# Altium project Evb board STM32H7 Fullcolor V1l0.PrjPcb (part 2 of 2)

## Sheet [06] - AUDIO.SchDoc
size A3; DocumentNumber: 7; SheetNumber: 6; SheetTotal: 10
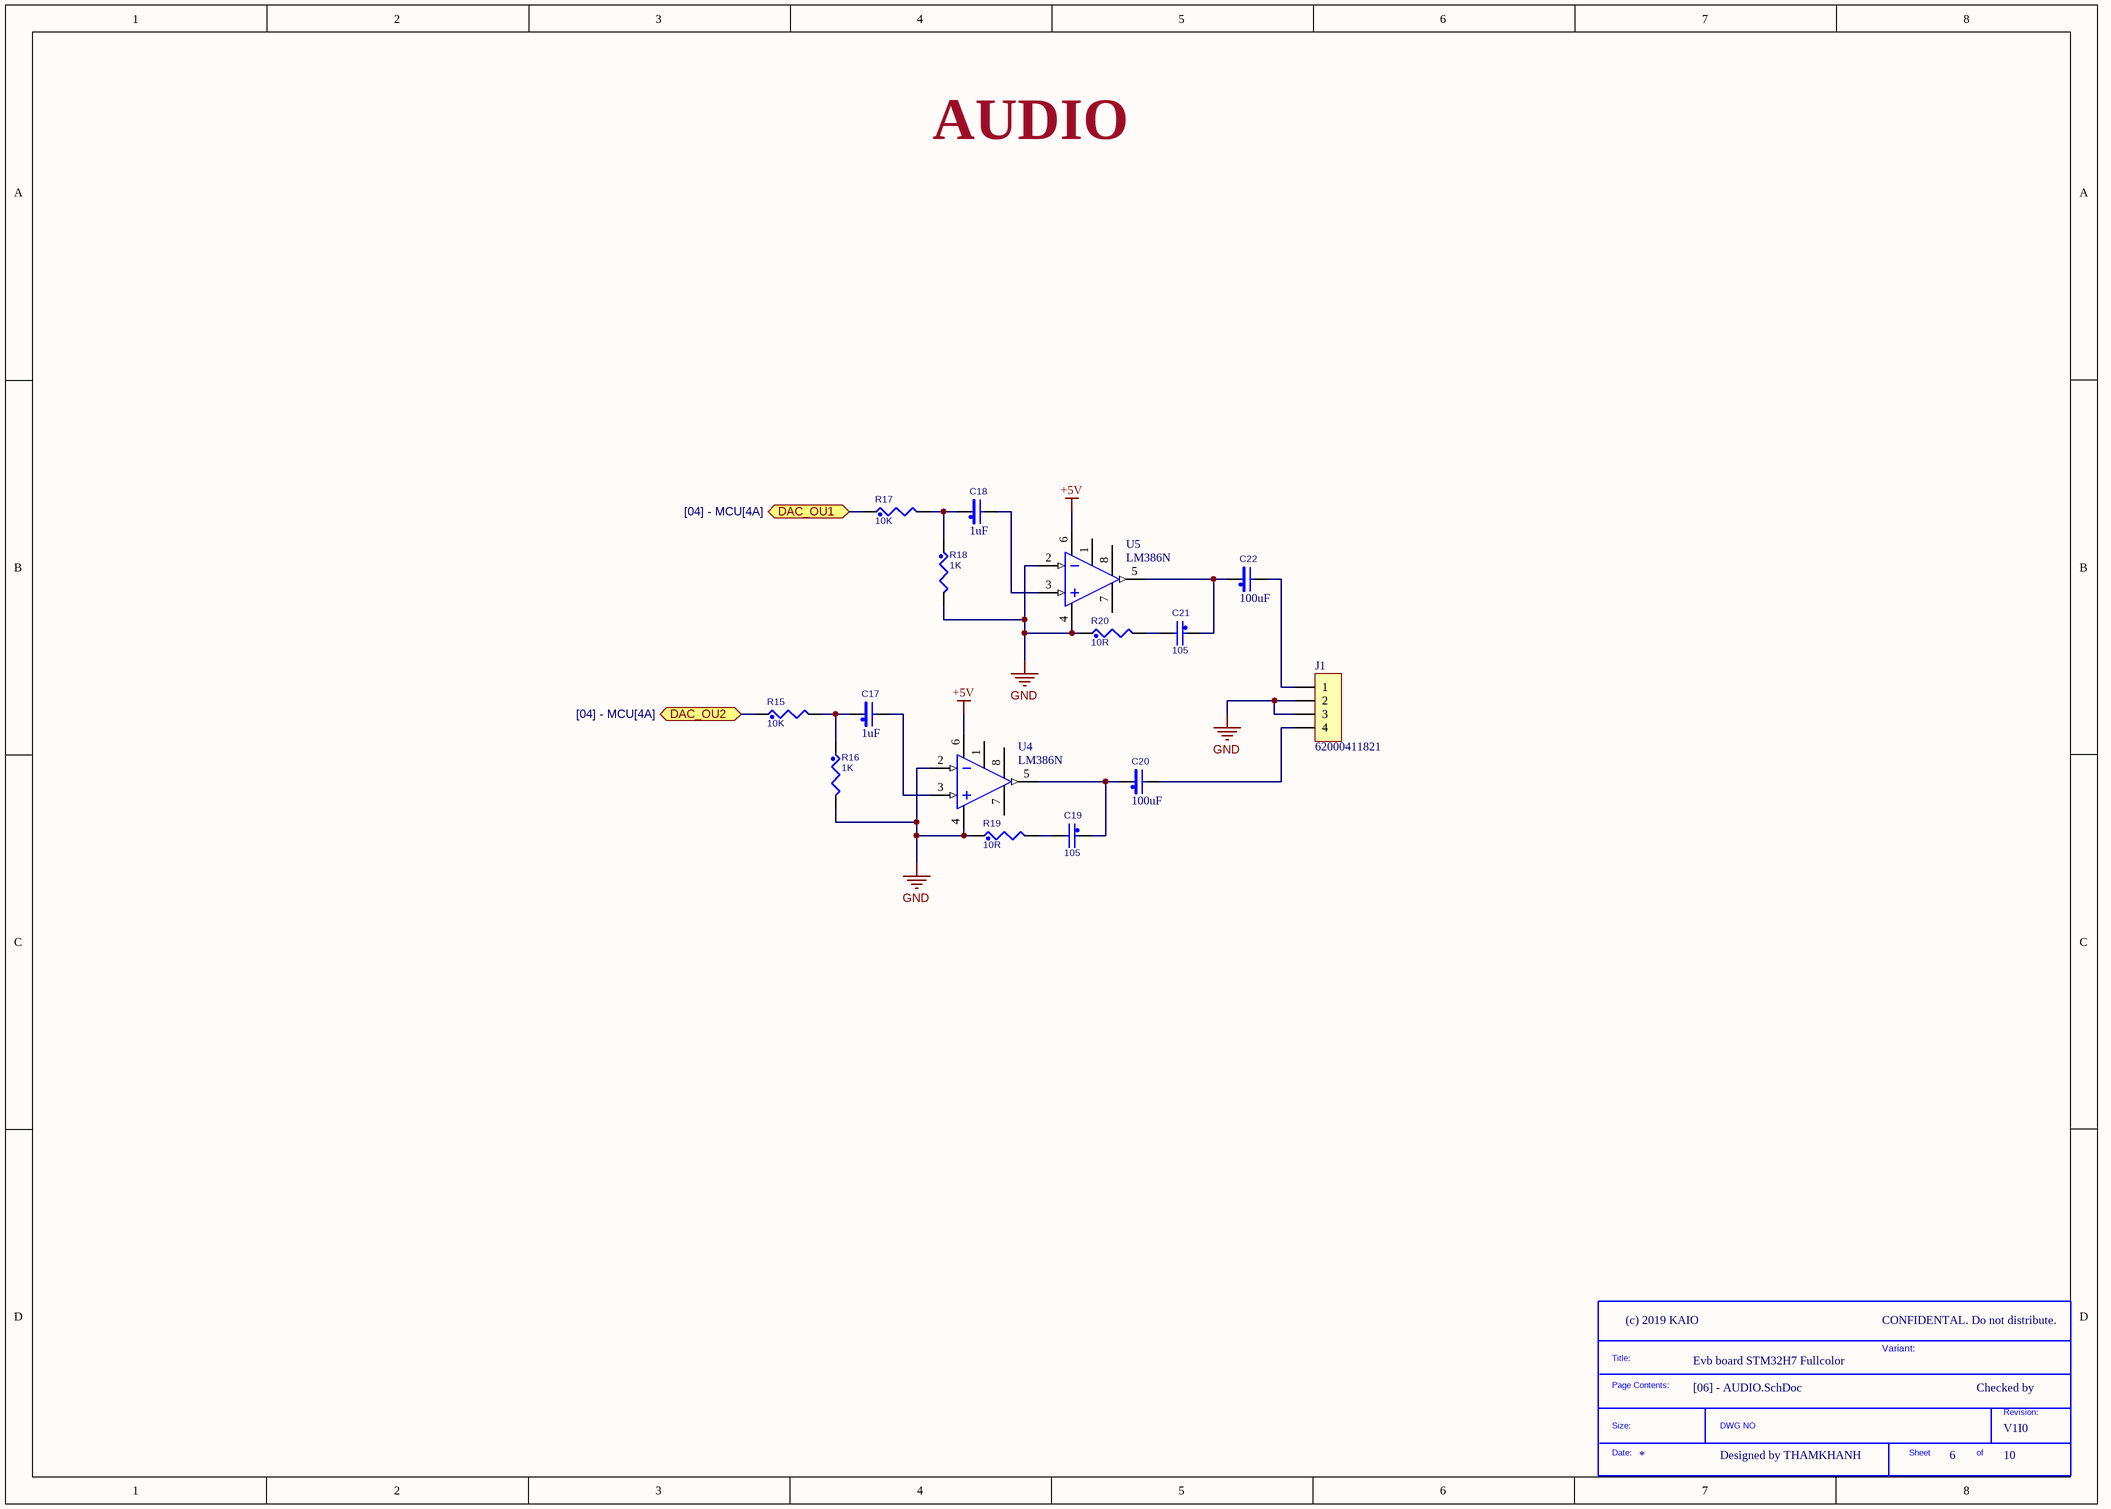
[diagram p6: [06] - AUDIO.SchDoc]

### Parts
(Parts that share a designator on the sheet are numbered #1, #2 ... from top to bottom, then left to right.)
*?#6  SDTitleBlock  (value not drawn)  (graphical)
C17  1uF  [CAP-TAN-SMD-3216]
C18  1uF  [CAP-TAN-SMD-3216]
C19  105  [C0805]
C20  100uF  [CAP-TAN-SMD-3530]
C21  105  [C0805]
C22  100uF  [CAP-TAN-SMD-3530]
J1  62000411821  [62000411121]
R15  10K  [R0603]
R16  1K  [R0603]
R17  10K  [R0603]
R18  1K  [R0603]
R19  10R  [R0805]
R20  10R  [R0805]
U4  LM386N  [SOIC127P390X490-8N]
U5  LM386N  [SOIC127P390X490-8N]

### Ports
DAC_OU1 (bidir, see [04] - MCU[4A]), DAC_OU2 (bidir, see [04] - MCU[4A])

### Nets
+5V: U4.6(+V) U5.6(+V)
GND: J1.2 J1.3 R16.2 R18.2 R19.1 R20.1 U4.2(IN-) U4.4(-V) U5.2(IN-) U5.4(-V)
DAC_OU1: R17.1 ; port DAC_OU1
DAC_OU2: R15.1 ; port DAC_OU2
NetC17_1: C17.1 R15.2 R16.1
NetC17_2: C17.2 U4.3(IN+)
NetC18_1: C18.1 R17.2 R18.1
NetC18_2: C18.2 U5.3(IN+)
NetC19_1: C19.1 C20.1 U4.5(OUT)
NetC19_2: C19.2 R19.2
NetC20_2: C20.2 J1.4
NetC21_1: C21.1 C22.1 U5.5(OUT)
NetC21_2: C21.2 R20.2
NetC22_2: C22.2 J1.1

Not connected (* = marked no-connect by the designer): U4 1(-V) 7 8(-V); U5 1(-V) 7 8(-V)

### Notes on the sheet
- AUDIO
- CONFIDENTAL. Do not distribute.
- Variant:
- Checked by
- Designed by THAMKHANH
- (in symbol SDTitleBlock) Title:; Page Contents:; Revision:; Size:; DWG NO; Date:; Sheet; of

### Library data of the parts
C17 C18 = CAP-SMD-TANTALUM: Tantalum capacitor , T491A475K016AT, KEMET; Manufacturer Part Number: T491A105K016AT; Tolerance: 20%; Voltage Rating: 16V; ESR (Equivalent Series Resistance): 10R; Leakage Current: 500nA; Polarity: Polar; Dissipation Factor: 4%; Life (Hours): 2000Hour; Ripple Current: 87mA; Manufacturer: KEMET; Mount: Surface Mount,PCB; Case/Package: 1206; Number of Pins: 2; Case Code (Imperial): 1206; Case Code (Metric): 3216; Dielectric Material: Tantalum; Min Operating Temperature: -55°C; Max Operating Temperature: 125°C; Capacitance: 1uF; Packaging: Tape and Reel; Package Quantity: 1; Voltage Rating (DC): 16V; Termination: SMD/SMT; Voltage: 16V; Features: General Purpose; Length: 3.2mm; Height: 1.6mm; Width: 1.6mm; Height - Seated (Max): 0.071inch; Depth: 1.6mm; REACH SVHC: No SVHC; Lead Free: Lead Free; ComponentLink1URL: https://4donline.ihs.com/images/VipMasterIC/IC/KEME/KEME-S-A0006487387/KEME-S-A0006487387-1.pdf?hkey=52A5661711E402568146F3353EA87419&src-supplier=Element14; ComponentLink1Description: https://4donline.ihs.com/images/VipMasterIC/IC/KEME/KEME-S-A0006487387/KEME-S-A0006487387-1.pdf?hkey=52A5661711E402568146F3353EA87419&src-supplier=Element14; ComponentLink2URL: http://www.rapidonline.com/pdf/458280_da_en_01.pdf?src-supplier=Rapid+Electronics; ComponentLink2Description: http://www.rapidonline.com/pdf/458280_da_en_01.pdf?src-supplier=Rapid+Electronics; ComponentLink3URL: http://www.jameco.com/Jameco/Products/ProdDS/1573169.pdf?src-supplier=Jameco; ComponentLink3Description: http://www.jameco.com/Jameco/Products/ProdDS/1573169.pdf?src-supplier=Jameco; ComponentLink4URL: http://www.kemet.com/kemet/web/homepage/kechome.nsf/file/T491%20Series/$file/KEM_T2005_T491.pdf?src-supplier=Farnell; ComponentLink4Description: http://www.kemet.com/kemet/web/homepage/kechome.nsf/file/T491%20Series/$file/KEM_T2005_T491.pdf?src-supplier=Farnell; ComponentLink5URL: http://www.mouser.com/ds/2/212/KEM_T2005_T491-1093550.pdf?src-supplier=Mouser; ComponentLink5Description: http://www.mouser.com/ds/2/212/KEM_T2005_T491-1093550.pdf?src-supplier=Mouser; ComponentLink6URL: https://www.distrelec.biz/Web/Downloads/_t/ds/KEM_T2005_T491_eng_tds.pdf?mime=application%2Fpdf&src-supplier=Distrelec; ComponentLink6Description: https://www.distrelec.biz/Web/Downloads/_t/ds/KEM_T2005_T491_eng_tds.pdf?mime=application%2Fpdf&src-supplier=Distrelec; ComponentLink7URL: https://api.kemet.com/component-edge/download/datasheet/T491A105K016AT.pdf?src-supplier=Digi-Key; ComponentLink7Description: https://api.kemet.com/component-edge/download/datasheet/T491A105K016AT.pdf?src-supplier=Digi-Key; ComponentLink8URL: http://www.kemet.com/kemet/web/homepage/kechome.nsf/file/T491%20Series/$file/KEM_T2005_T491.pdf?src-supplier=Element14; ComponentLink8Description: http://www.kemet.com/kemet/web/homepage/kechome.nsf/file/T491%20Series/$file/KEM_T2005_T491.pdf?src-supplier=Element14; ComponentLink9URL: http://uk.rs-online.com/webdocs/1529/0900766b815290c9.pdf?src-supplier=RSComponents; ComponentLink9Description: http://uk.rs-online.com/webdocs/1529/0900766b815290c9.pdf?src-supplier=RSComponents; ComponentLink10URL: https://www.alliedelec.com/m/d/1172a60f7bb3eb66344f86e8fb9ddbde.pdf?src-supplier=Allied+Electronics; ComponentLink10Description: https://www.alliedelec.com/m/d/1172a60f7bb3eb66344f86e8fb9ddbde.pdf?src-supplier=Allied+Electronics; Radiation Hardening: No; ComponentLink11URL: https://api.kemet.com/component-edge/download/datasheet/T491A475K016AT.pdf?src-supplier=Digi-Key; ComponentLink11Description: https://api.kemet.com/component-edge/download/datasheet/T491A475K016AT.pdf?src-supplier=Digi-Key; ComponentLink12URL: http://www.jameco.com/Jameco/Products/ProdDS/1573425.pdf?src-supplier=Jameco; ComponentLink12Description: http://www.jameco.com/Jameco/Products/ProdDS/1573425.pdf?src-supplier=Jameco; ComponentLink13URL: http://uk.rs-online.com/webdocs/1515/0900766b81515525.pdf?src-supplier=RSComponents; ComponentLink13Description: http://uk.rs-online.com/webdocs/1515/0900766b81515525.pdf?src-supplier=RSComponents; ComponentLink14URL: http://www.farnell.com/datasheets/1854511.pdf?src-supplier=Element14; ComponentLink14Description: http://www.farnell.com/datasheets/1854511.pdf?src-supplier=Element14; ComponentLink15URL: http://www.rapidonline.com/pdf/458253_da_en_01.pdf?src-supplier=Rapid+Electronics; ComponentLink15Description: http://www.rapidonline.com/pdf/458253_da_en_01.pdf?src-supplier=Rapid+Electronics; ComponentLink16URL: https://produktinfo.conrad.com/datenblaetter/450000-474999/458253-da-01-en-TANTAL_KONDENSATOR_T491A475K016AT.pdf?src-supplier=Conrad; ComponentLink16Description: https://produktinfo.conrad.com/datenblaetter/450000-474999/458253-da-01-en-TANTAL_KONDENSATOR_T491A475K016AT.pdf?src-supplier=Conrad
C19 C21 = CAP-SMD-CERAMIC: Surface Mound Multilayer Ceramic Chip Capacitor (SMD MLCC); Manufacturer: TDK Corporation; Manufacturer Part Number: C2012X5R1C226K; Capacitance: 22pF; Voltage - Rated: 16V; Tolerance: ±10%; Temperature Coefficient: X5R; .Checked PCB: RF; RoHS: RoHS Compliant; Category: Capacitors; Mounting Type: Surface Mount, MLCC; Operating Temperature: -55°C ~ 85°C; Applications: General Purpose; Ratings: -; Package / Case: 0805 (2012 Metric); Size / Dimension: 0.079" L x 0.049" W (2.00mm x 1.25mm); Height - Seated (Max): -; Thickness (Max): 0.057" (1.45mm); Lead Spacing: -; Features: -; Packaging: Cut Tape (CT); Lead Style: -; ComponentLink1URL: http://www.tdk.com/pdf/general_B11.pdf; ComponentLink1Description: http://www.tdk.com/pdf/general_B11.pdf; .Checked SCH: RF
C20 C22 = CAP-SMD-TANTALUM: Tantalum capacitor , T491A475K016AT, KEMET; Manufacturer Part Number: T491A105K016AT; Capacitance: 1uF; Tolerance: 20%; Voltage Rating: 16V; ESR (Equivalent Series Resistance): 10R; Leakage Current: 500nA; Polarity: Polar; Dissipation Factor: 4%; Life (Hours): 2000Hour; Ripple Current: 87mA; Manufacturer: KEMET; Mount: Surface Mount,PCB; Case/Package: 1206; Number of Pins: 2; Case Code (Imperial): 1206; Case Code (Metric): 3216; Dielectric Material: Tantalum; Min Operating Temperature: -55°C; Max Operating Temperature: 125°C; Packaging: Tape and Reel; Package Quantity: 1; Voltage Rating (DC): 16V; Termination: SMD/SMT; Voltage: 16V; Features: General Purpose; Length: 3.2mm; Height: 1.6mm; Width: 1.6mm; Height - Seated (Max): 0.071inch; Depth: 1.6mm; REACH SVHC: No SVHC; Lead Free: Lead Free; ComponentLink1URL: https://4donline.ihs.com/images/VipMasterIC/IC/KEME/KEME-S-A0006487387/KEME-S-A0006487387-1.pdf?hkey=52A5661711E402568146F3353EA87419&src-supplier=Element14; ComponentLink1Description: https://4donline.ihs.com/images/VipMasterIC/IC/KEME/KEME-S-A0006487387/KEME-S-A0006487387-1.pdf?hkey=52A5661711E402568146F3353EA87419&src-supplier=Element14; ComponentLink2URL: http://www.rapidonline.com/pdf/458280_da_en_01.pdf?src-supplier=Rapid+Electronics; ComponentLink2Description: http://www.rapidonline.com/pdf/458280_da_en_01.pdf?src-supplier=Rapid+Electronics; ComponentLink3URL: http://www.jameco.com/Jameco/Products/ProdDS/1573169.pdf?src-supplier=Jameco; ComponentLink3Description: http://www.jameco.com/Jameco/Products/ProdDS/1573169.pdf?src-supplier=Jameco; ComponentLink4URL: http://www.kemet.com/kemet/web/homepage/kechome.nsf/file/T491%20Series/$file/KEM_T2005_T491.pdf?src-supplier=Farnell; ComponentLink4Description: http://www.kemet.com/kemet/web/homepage/kechome.nsf/file/T491%20Series/$file/KEM_T2005_T491.pdf?src-supplier=Farnell; ComponentLink5URL: http://www.mouser.com/ds/2/212/KEM_T2005_T491-1093550.pdf?src-supplier=Mouser; ComponentLink5Description: http://www.mouser.com/ds/2/212/KEM_T2005_T491-1093550.pdf?src-supplier=Mouser; ComponentLink6URL: https://www.distrelec.biz/Web/Downloads/_t/ds/KEM_T2005_T491_eng_tds.pdf?mime=application%2Fpdf&src-supplier=Distrelec; ComponentLink6Description: https://www.distrelec.biz/Web/Downloads/_t/ds/KEM_T2005_T491_eng_tds.pdf?mime=application%2Fpdf&src-supplier=Distrelec; ComponentLink7URL: https://api.kemet.com/component-edge/download/datasheet/T491A105K016AT.pdf?src-supplier=Digi-Key; ComponentLink7Description: https://api.kemet.com/component-edge/download/datasheet/T491A105K016AT.pdf?src-supplier=Digi-Key; ComponentLink8URL: http://www.kemet.com/kemet/web/homepage/kechome.nsf/file/T491%20Series/$file/KEM_T2005_T491.pdf?src-supplier=Element14; ComponentLink8Description: http://www.kemet.com/kemet/web/homepage/kechome.nsf/file/T491%20Series/$file/KEM_T2005_T491.pdf?src-supplier=Element14; ComponentLink9URL: http://uk.rs-online.com/webdocs/1529/0900766b815290c9.pdf?src-supplier=RSComponents; ComponentLink9Description: http://uk.rs-online.com/webdocs/1529/0900766b815290c9.pdf?src-supplier=RSComponents; ComponentLink10URL: https://www.alliedelec.com/m/d/1172a60f7bb3eb66344f86e8fb9ddbde.pdf?src-supplier=Allied+Electronics; ComponentLink10Description: https://www.alliedelec.com/m/d/1172a60f7bb3eb66344f86e8fb9ddbde.pdf?src-supplier=Allied+Electronics; Radiation Hardening: No; ComponentLink11URL: https://api.kemet.com/component-edge/download/datasheet/T491A475K016AT.pdf?src-supplier=Digi-Key; ComponentLink11Description: https://api.kemet.com/component-edge/download/datasheet/T491A475K016AT.pdf?src-supplier=Digi-Key; ComponentLink12URL: http://www.jameco.com/Jameco/Products/ProdDS/1573425.pdf?src-supplier=Jameco; ComponentLink12Description: http://www.jameco.com/Jameco/Products/ProdDS/1573425.pdf?src-supplier=Jameco; ComponentLink13URL: http://uk.rs-online.com/webdocs/1515/0900766b81515525.pdf?src-supplier=RSComponents; ComponentLink13Description: http://uk.rs-online.com/webdocs/1515/0900766b81515525.pdf?src-supplier=RSComponents; ComponentLink14URL: http://www.farnell.com/datasheets/1854511.pdf?src-supplier=Element14; ComponentLink14Description: http://www.farnell.com/datasheets/1854511.pdf?src-supplier=Element14; ComponentLink15URL: http://www.rapidonline.com/pdf/458253_da_en_01.pdf?src-supplier=Rapid+Electronics; ComponentLink15Description: http://www.rapidonline.com/pdf/458253_da_en_01.pdf?src-supplier=Rapid+Electronics; ComponentLink16URL: https://produktinfo.conrad.com/datenblaetter/450000-474999/458253-da-01-en-TANTAL_KONDENSATOR_T491A475K016AT.pdf?src-supplier=Conrad; ComponentLink16Description: https://produktinfo.conrad.com/datenblaetter/450000-474999/458253-da-01-en-TANTAL_KONDENSATOR_T491A475K016AT.pdf?src-supplier=Conrad
J1 = JP4 2.00MM Single Socket: WR-PHD 2.00 mm Socket Header; Manufacturer: W¨¹rth Elektronik eiSos GmbH; ComponentLink1 Description: Manufacturer; ComponentLink2 Description: Datasheet; NoPins: 04; Created Date: 2 April 2013; partNo: 62000411821; ComponentLink1URL: http://www.we-online.com; ComponentLink2URL: http://katalog.we-online.de/em/datasheet/6200xx11821.pdf; Created by: Karrer Zheng
R15-R20 = RES-SMD: RES 0R OHM 1/8W 1% SMD; Manufacturer: Yageo; Manufacturer Part Number: RC0402FR-0749R9L; Power (Watts): 0.063W, 1/16W; .Checked PCB: used; Temperature Coefficient: ±100ppm/°C; Resistance: 3.3kR; Power Rating: 125mW; Voltage Rating: 100V; Category: Resistors; Supplier Part Number: 311-49.9LRCT-ND; Package / Case: 0402 (1005 Metric); Price 1k [$]: 0.01421; Tolerance: ±1%; Value: 0R; .Checked SCH: used; Supplier: Digikey; RoHS: RoHS Compliant; Composition: Thick Film; Features: -; Size / Dimension: 0.039" L x 0.020" W (1.00mm x 0.50mm); Height: 0.016" (0.40mm); Number of Terminations: 2; Packaging: Cut Tape (CT); ComponentLink1URL: http://www.yageo.com/documents/recent/PYu-RC0402_51_RoHS_L_6.pdf; ComponentLink1Description: http://www.yageo.com/documents/recent/PYu-RC0402_51_RoHS_L_6.pdf; Resistance (Ohms): 0R; Mount: Surface Mount; Case/Package: 0805; Number of Pins: 2; Contact Plating: Tin; Case Code (Metric): 2012; Case Code (Imperial): 0805; Min Operating Temperature: -55°C; Max Operating Temperature: 155°C; Package Quantity: 1; Termination: SMD/SMT; Military Standard: Not; Max Power Dissipation: 125mW; Voltage Rating (DC): 100V; Length: 2mm; Width: 1.25mm; Depth: 1.25mm; Radiation Hardening: No; REACH SVHC: No SVHC; Lead Free: Lead Free; ComponentLink2URL: http://www.farnell.com/datasheets/485442.pdf?src-supplier=Farnell; ComponentLink2Description: http://www.farnell.com/datasheets/485442.pdf?src-supplier=Farnell; ComponentLink3URL: http://uk.rs-online.com/webdocs/0bee/0900766b80beefcc.pdf?src-supplier=RSComponents; ComponentLink3Description: http://uk.rs-online.com/webdocs/0bee/0900766b80beefcc.pdf?src-supplier=RSComponents; ComponentLink4URL: http://industrial.panasonic.com/www-data/pdf/AOA0000/AOA0000CE26.pdf?src-supplier=Future+Electronics; ComponentLink4Description: http://industrial.panasonic.com/www-data/pdf/AOA0000/AOA0000CE26.pdf?src-supplier=Future+Electronics; ComponentLink5URL: https://www.alliedelec.com/m/d/b6b0537e86f421aa7f5975bb1d8f429a.pdf?src-supplier=Allied+Electronics; ComponentLink5Description: https://www.alliedelec.com/m/d/b6b0537e86f421aa7f5975bb1d8f429a.pdf?src-supplier=Allied+Electronics; ComponentLink6URL: http://industrial.panasonic.com/www-data/pdf/AOA0000/AOA0000CE26.pdf?src-supplier=Avnet; ComponentLink6Description: http://industrial.panasonic.com/www-data/pdf/AOA0000/AOA0000CE26.pdf?src-supplier=Avnet; ComponentLink7URL: http://industrial.panasonic.com/www-data/pdf/AOA0000/AOA0000CE26.pdf?src-supplier=Avnet+Europe; ComponentLink7Description: http://industrial.panasonic.com/www-data/pdf/AOA0000/AOA0000CE26.pdf?src-supplier=Avnet+Europe; ComponentLink8URL: http://industrial.panasonic.com/cdbs/www-data/pdf/RDM0000/AOA0000C307.pdf?src-supplier=Farnell; ComponentLink8Description: http://industrial.panasonic.com/cdbs/www-data/pdf/RDM0000/AOA0000C307.pdf?src-supplier=Farnell; ComponentLink9URL: https://www.distrelec.biz/Web/Downloads/_t/ds/ERA_eng_tds.pdf?mime=application%2Fpdf&src-supplier=Distrelec; ComponentLink9Description: https://www.distrelec.biz/Web/Downloads/_t/ds/ERA_eng_tds.pdf?mime=application%2Fpdf&src-supplier=Distrelec; ComponentLink10URL: http://www.farnell.com/datasheets/485442.pdf?src-supplier=Element14; ComponentLink10Description: http://www.farnell.com/datasheets/485442.pdf?src-supplier=Element14; ComponentLink11URL: http://www.farnell.com/datasheets/2052875.pdf?src-supplier=Farnell; ComponentLink11Description: http://www.farnell.com/datasheets/2052875.pdf?src-supplier=Farnell; ComponentLink12URL: http://www.farnell.com/datasheets/2059650.pdf?src-supplier=Farnell; ComponentLink12Description: http://www.farnell.com/datasheets/2059650.pdf?src-supplier=Farnell; ComponentLink13URL: https://produktinfo.conrad.com/datenblaetter/450000-474999/453184-da-01-en-WIDERSTAND_0805_ERA.pdf?src-supplier=Conrad; ComponentLink13Description: https://produktinfo.conrad.com/datenblaetter/450000-474999/453184-da-01-en-WIDERSTAND_0805_ERA.pdf?src-supplier=Conrad
U4 U5 = LM386N: TEXAS INSTRUMENTS         LM386N-3/NOPB            AUDIO POWER AMPLIFIER, CLASS AB, 700mW DIP-8

## Sheet [07] - OTHER.SchDoc
size A3; DocumentNumber: 8; SheetNumber: 7; SheetTotal: 10
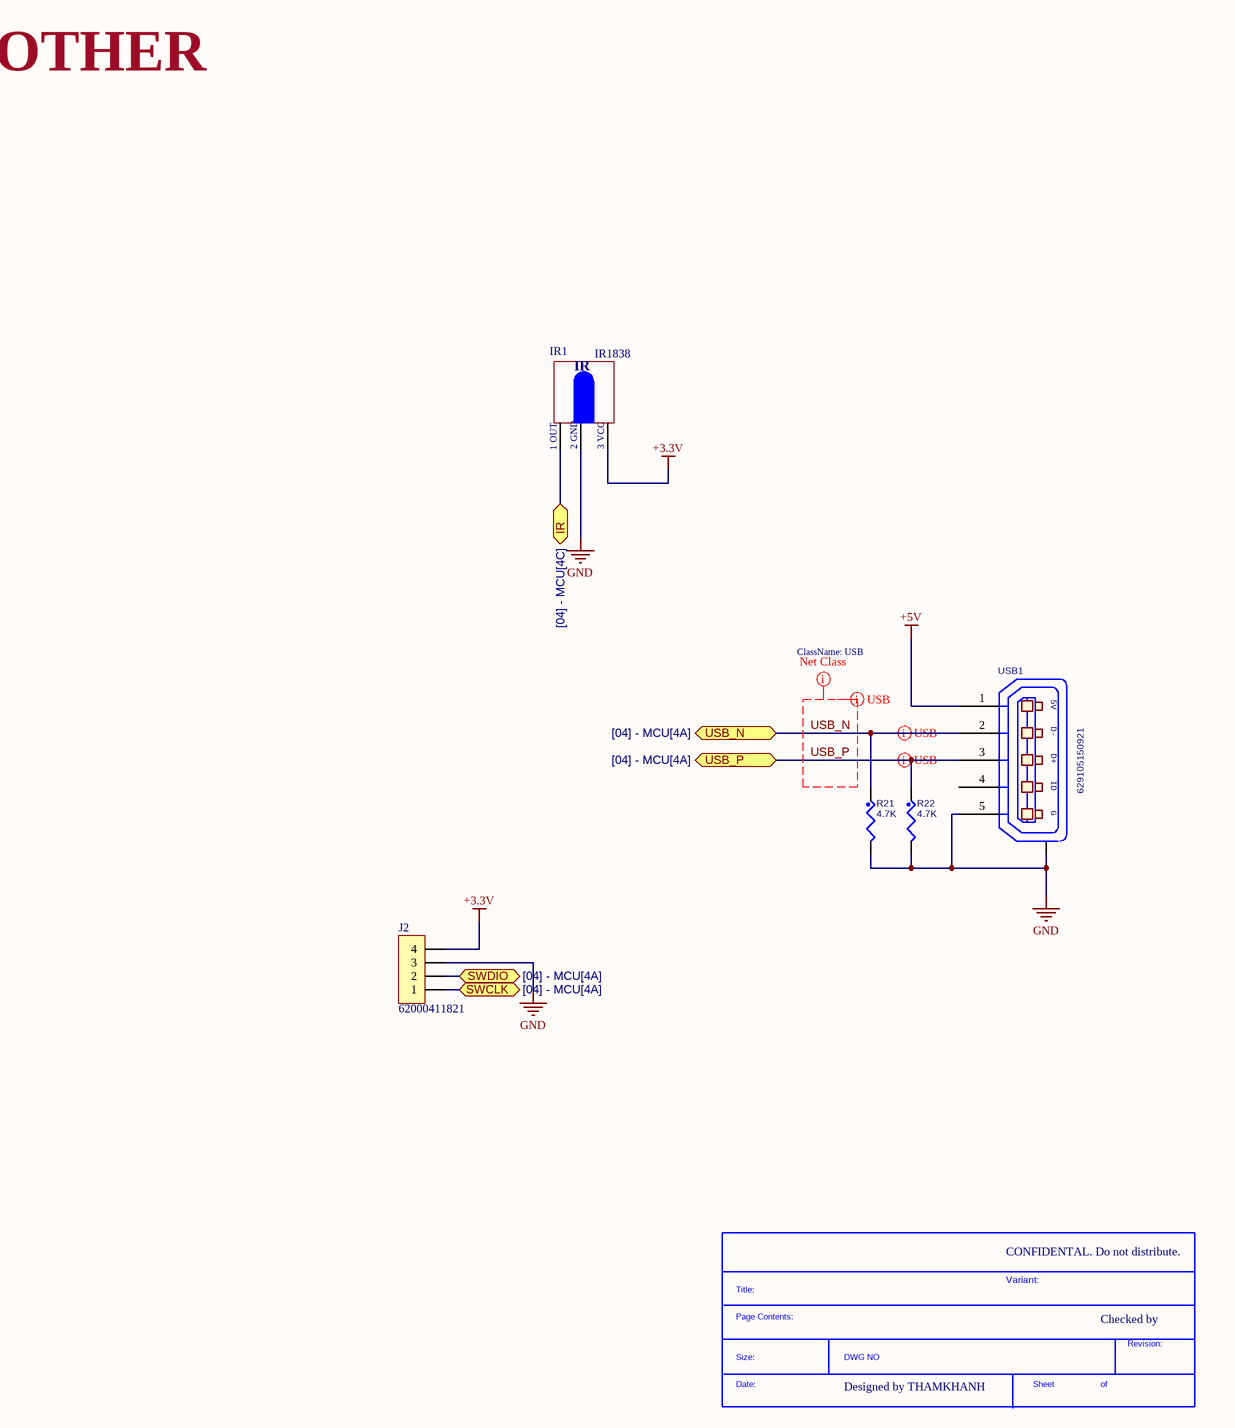
[diagram p7: [07] - OTHER.SchDoc]

### Parts
(Parts that share a designator on the sheet are numbered #1, #2 ... from top to bottom, then left to right.)
*?#7  SDTitleBlock  (value not drawn)  (graphical)
IR1  IR1838  [IR RECEIVE V1]
J2  62000411821  [62000411121]
R21  4.7K  [R0603]
R22  4.7K  [R0603]
USB1  629105150921  [USB-629105150921]

### Ports
IR (bidir, see [04] - MCU[4C]), SWCLK (bidir, see [04] - MCU[4A]), SWDIO (bidir, see [04] - MCU[4A]), USB_N (bidir, see [04] - MCU[4A]), USB_P (bidir, see [04] - MCU[4A])

### Nets
+3.3V: IR1.3(VCC) J2.4
+5V: USB1.1(P1)
GND: IR1.2(GND) J2.3 R21.2 R22.2 USB1.0(GND) USB1.5(P5)
IR: IR1.1(Out) ; port IR
SWCLK: J2.1 ; port SWCLK
SWDIO: J2.2 ; port SWDIO
USB_N: R21.1 USB1.2(P2) ; port USB_N
USB_P: R22.1 USB1.3(P3) ; port USB_P

Not connected (* = marked no-connect by the designer): USB1 4(P4)

### Layout directives
differential pair: USB_N, USB_P
net class USB: USB_N, USB_P

### Notes on the sheet
- OTHER
- CONFIDENTAL. Do not distribute.
- Variant:
- Checked by
- Designed by THAMKHANH
- (in symbol IR1838) IR; 1 OUT; 2 GND; 3 VCC
- (in symbol SDTitleBlock) Title:; Page Contents:; Revision:; Size:; DWG NO; Date:; Sheet; of
- (in symbol USB 2.0 Micro Type AB Female) 5V; D-; D+; ID; G

### Library data of the parts
IR1 = IR1838: VISHAY SEMICONDUCTOR   TSOP31238   IR RECEIVER, 40M, 38KHZ, SIP
J2 = JP4 2.00MM Single Socket: as J1 on sheet [06] - AUDIO; Created Date: 2 April 2013; partNo: 62000411821; ComponentLink1URL: http://www.we-online.com; ComponentLink2URL: http://katalog.we-online.de/em/datasheet/6200xx11821.pdf; Created by: Karrer Zheng
R21 R22 = RES-SMD: as R15 on sheet [06] - AUDIO; Category: Resistors; Supplier Part Number: 311-49.9LRCT-ND; Package / Case: 0402 (1005 Metric); Price 1k [$]: 0.01421; Tolerance: ±1%; Value: 0R; .Checked SCH: used; Supplier: Digikey; RoHS: RoHS Compliant; Composition: Thick Film; Features: -; Size / Dimension: 0.039" L x 0.020" W (1.00mm x 0.50mm); Height: 0.016" (0.40mm); Number of Terminations: 2; Packaging: Cut Tape (CT); ComponentLink1URL: http://www.yageo.com/documents/recent/PYu-RC0402_51_RoHS_L_6.pdf; ComponentLink1Description: http://www.yageo.com/documents/recent/PYu-RC0402_51_RoHS_L_6.pdf; Resistance (Ohms): 0R; Mount: Surface Mount; Case/Package: 0805; Number of Pins: 2; Contact Plating: Tin; Case Code (Metric): 2012; Case Code (Imperial): 0805; Min Operating Temperature: -55°C; Max Operating Temperature: 155°C; Package Quantity: 1; Termination: SMD/SMT; Military Standard: Not; Max Power Dissipation: 125mW; Voltage Rating (DC): 100V; Length: 2mm; Width: 1.25mm; Depth: 1.25mm; Radiation Hardening: No; REACH SVHC: No SVHC; Lead Free: Lead Free; ComponentLink2URL: http://www.farnell.com/datasheets/485442.pdf?src-supplier=Farnell; ComponentLink2Description: http://www.farnell.com/datasheets/485442.pdf?src-supplier=Farnell; ComponentLink3URL: http://uk.rs-online.com/webdocs/0bee/0900766b80beefcc.pdf?src-supplier=RSComponents; ComponentLink3Description: http://uk.rs-online.com/webdocs/0bee/0900766b80beefcc.pdf?src-supplier=RSComponents; ComponentLink4URL: http://industrial.panasonic.com/www-data/pdf/AOA0000/AOA0000CE26.pdf?src-supplier=Future+Electronics; ComponentLink4Description: http://industrial.panasonic.com/www-data/pdf/AOA0000/AOA0000CE26.pdf?src-supplier=Future+Electronics; ComponentLink5URL: https://www.alliedelec.com/m/d/b6b0537e86f421aa7f5975bb1d8f429a.pdf?src-supplier=Allied+Electronics; ComponentLink5Description: https://www.alliedelec.com/m/d/b6b0537e86f421aa7f5975bb1d8f429a.pdf?src-supplier=Allied+Electronics; ComponentLink6URL: http://industrial.panasonic.com/www-data/pdf/AOA0000/AOA0000CE26.pdf?src-supplier=Avnet; ComponentLink6Description: http://industrial.panasonic.com/www-data/pdf/AOA0000/AOA0000CE26.pdf?src-supplier=Avnet; ComponentLink7URL: http://industrial.panasonic.com/www-data/pdf/AOA0000/AOA0000CE26.pdf?src-supplier=Avnet+Europe; ComponentLink7Description: http://industrial.panasonic.com/www-data/pdf/AOA0000/AOA0000CE26.pdf?src-supplier=Avnet+Europe; ComponentLink8URL: http://industrial.panasonic.com/cdbs/www-data/pdf/RDM0000/AOA0000C307.pdf?src-supplier=Farnell; ComponentLink8Description: http://industrial.panasonic.com/cdbs/www-data/pdf/RDM0000/AOA0000C307.pdf?src-supplier=Farnell; ComponentLink9URL: https://www.distrelec.biz/Web/Downloads/_t/ds/ERA_eng_tds.pdf?mime=application%2Fpdf&src-supplier=Distrelec; ComponentLink9Description: https://www.distrelec.biz/Web/Downloads/_t/ds/ERA_eng_tds.pdf?mime=application%2Fpdf&src-supplier=Distrelec; ComponentLink10URL: http://www.farnell.com/datasheets/485442.pdf?src-supplier=Element14; ComponentLink10Description: http://www.farnell.com/datasheets/485442.pdf?src-supplier=Element14; ComponentLink11URL: http://www.farnell.com/datasheets/2052875.pdf?src-supplier=Farnell; ComponentLink11Description: http://www.farnell.com/datasheets/2052875.pdf?src-supplier=Farnell; ComponentLink12URL: http://www.farnell.com/datasheets/2059650.pdf?src-supplier=Farnell; ComponentLink12Description: http://www.farnell.com/datasheets/2059650.pdf?src-supplier=Farnell; ComponentLink13URL: https://produktinfo.conrad.com/datenblaetter/450000-474999/453184-da-01-en-WIDERSTAND_0805_ERA.pdf?src-supplier=Conrad; ComponentLink13Description: https://produktinfo.conrad.com/datenblaetter/450000-474999/453184-da-01-en-WIDERSTAND_0805_ERA.pdf?src-supplier=Conrad
USB1 = USB 2.0 Micro Type AB Female: Micro USB 2.0 Type AB; PartVertical: 614105150621; Interface Type: Type AB; Gender: Receptacle; ComponentLink1Description: Manufacturer; ComponentLink1URL: http://www.we-online.de; ComponentLink2Description: Datasheet; ComponentLink2URL: http://katalog.we-online.de/em/datasheet/629105150921.pdf; PartHorizontal: 629105150921; Published Date: April 2017; Publisher: Wurth Elektronik; Sub-Family: Micro USB 2.0; Type: Horizontal; Construction: SMT

## Sheet [09] - REVISION HISTORY.SchDoc
size A3; Organization: Altium Limited; Address1: L3, 12a Rodborough Rd; Address2: Frenchs Forest; Address3: NSW; Address4: Australia 2086; DocumentNumber: 10; SheetNumber: 9; SheetTotal: 10
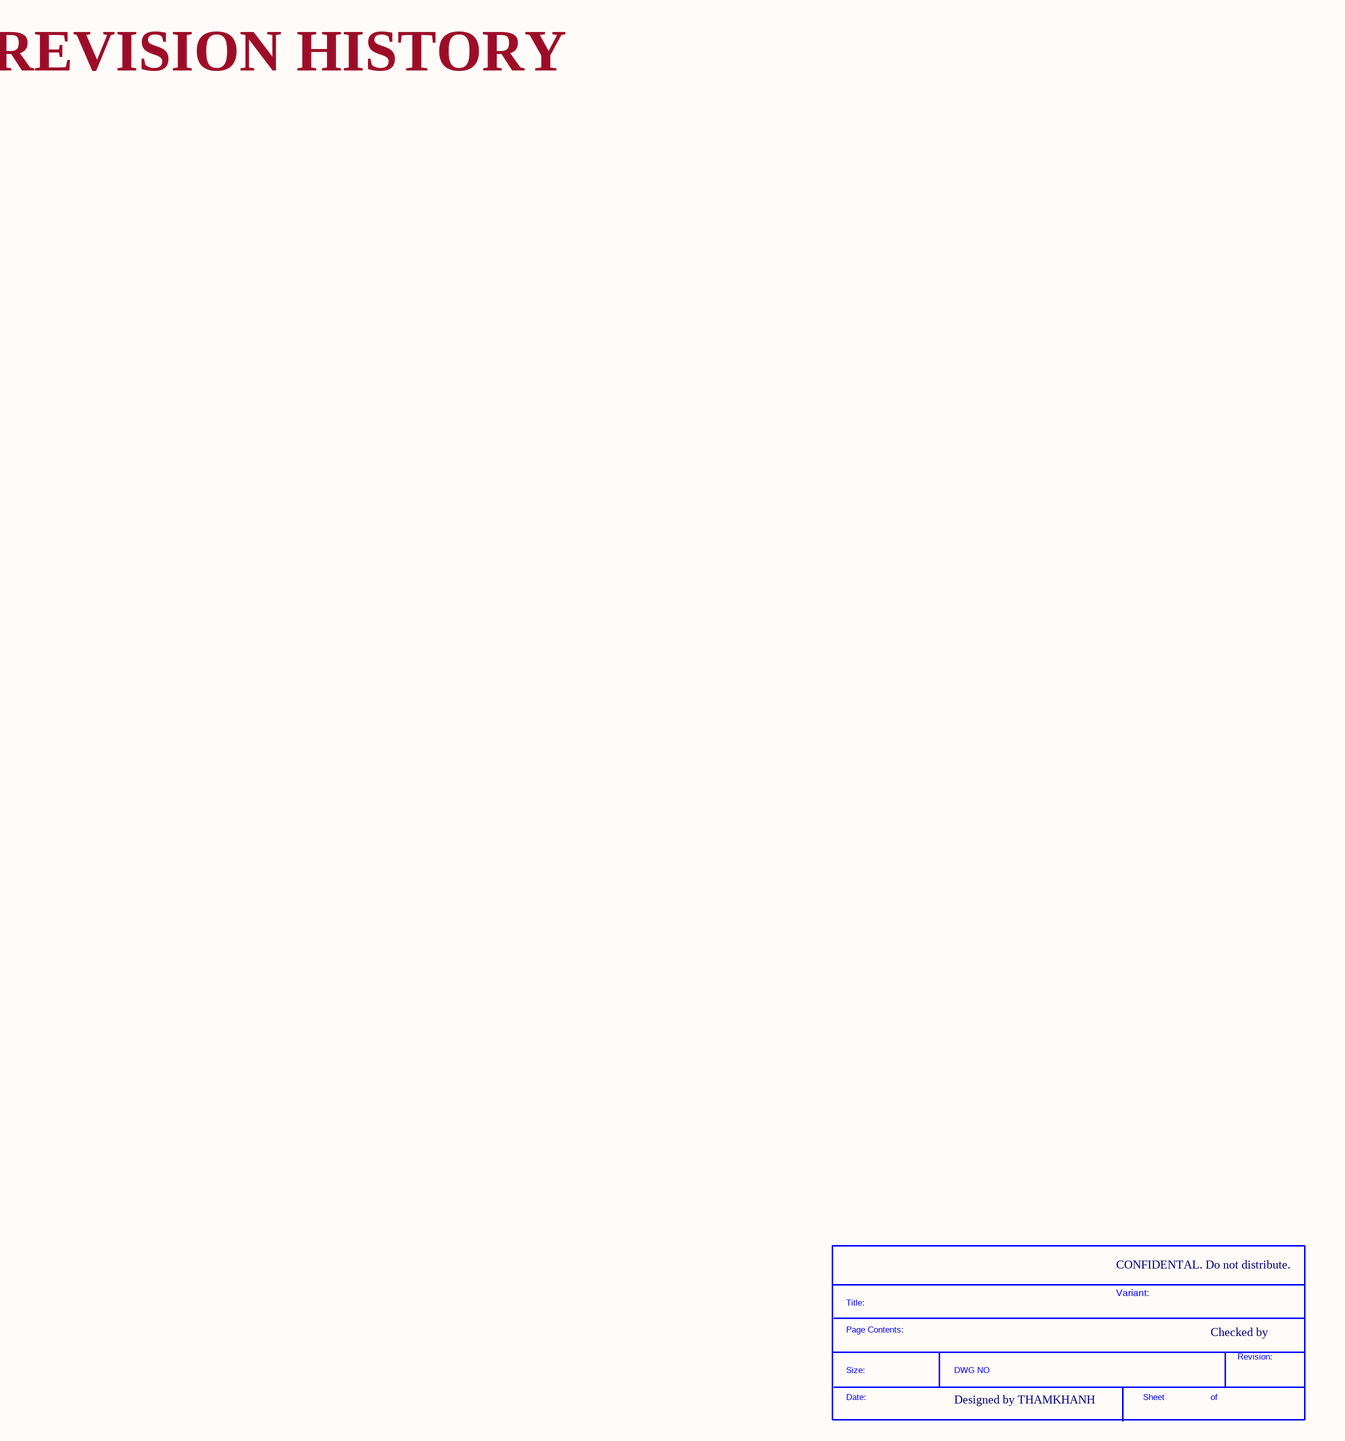
[diagram p8: [09] - REVISION HISTORY.SchDoc]

### Parts
(Parts that share a designator on the sheet are numbered #1, #2 ... from top to bottom, then left to right.)
*?#8  SDTitleBlock  (value not drawn)  (graphical)

### Notes on the sheet
- REVISION HISTORY
- CONFIDENTAL. Do not distribute.
- Variant:
- Checked by
- Designed by THAMKHANH
- Title
- Size:
- Date:
- A3
- Number:
- Time:
- Revision:
- Sheet
- of
- File:
- (in symbol SDTitleBlock) Title:; Page Contents:; Revision:; Size:; DWG NO; Date:; Sheet; of

## Sheet [08] - DISPLAY.SchDoc
size A3; Organization: Altium Limited; Address1: L3, 12a Rodborough Rd; Address2: Frenchs Forest; Address3: NSW; Address4: Australia 2086; DocumentNumber: 9; SheetNumber: 8; SheetTotal: 10
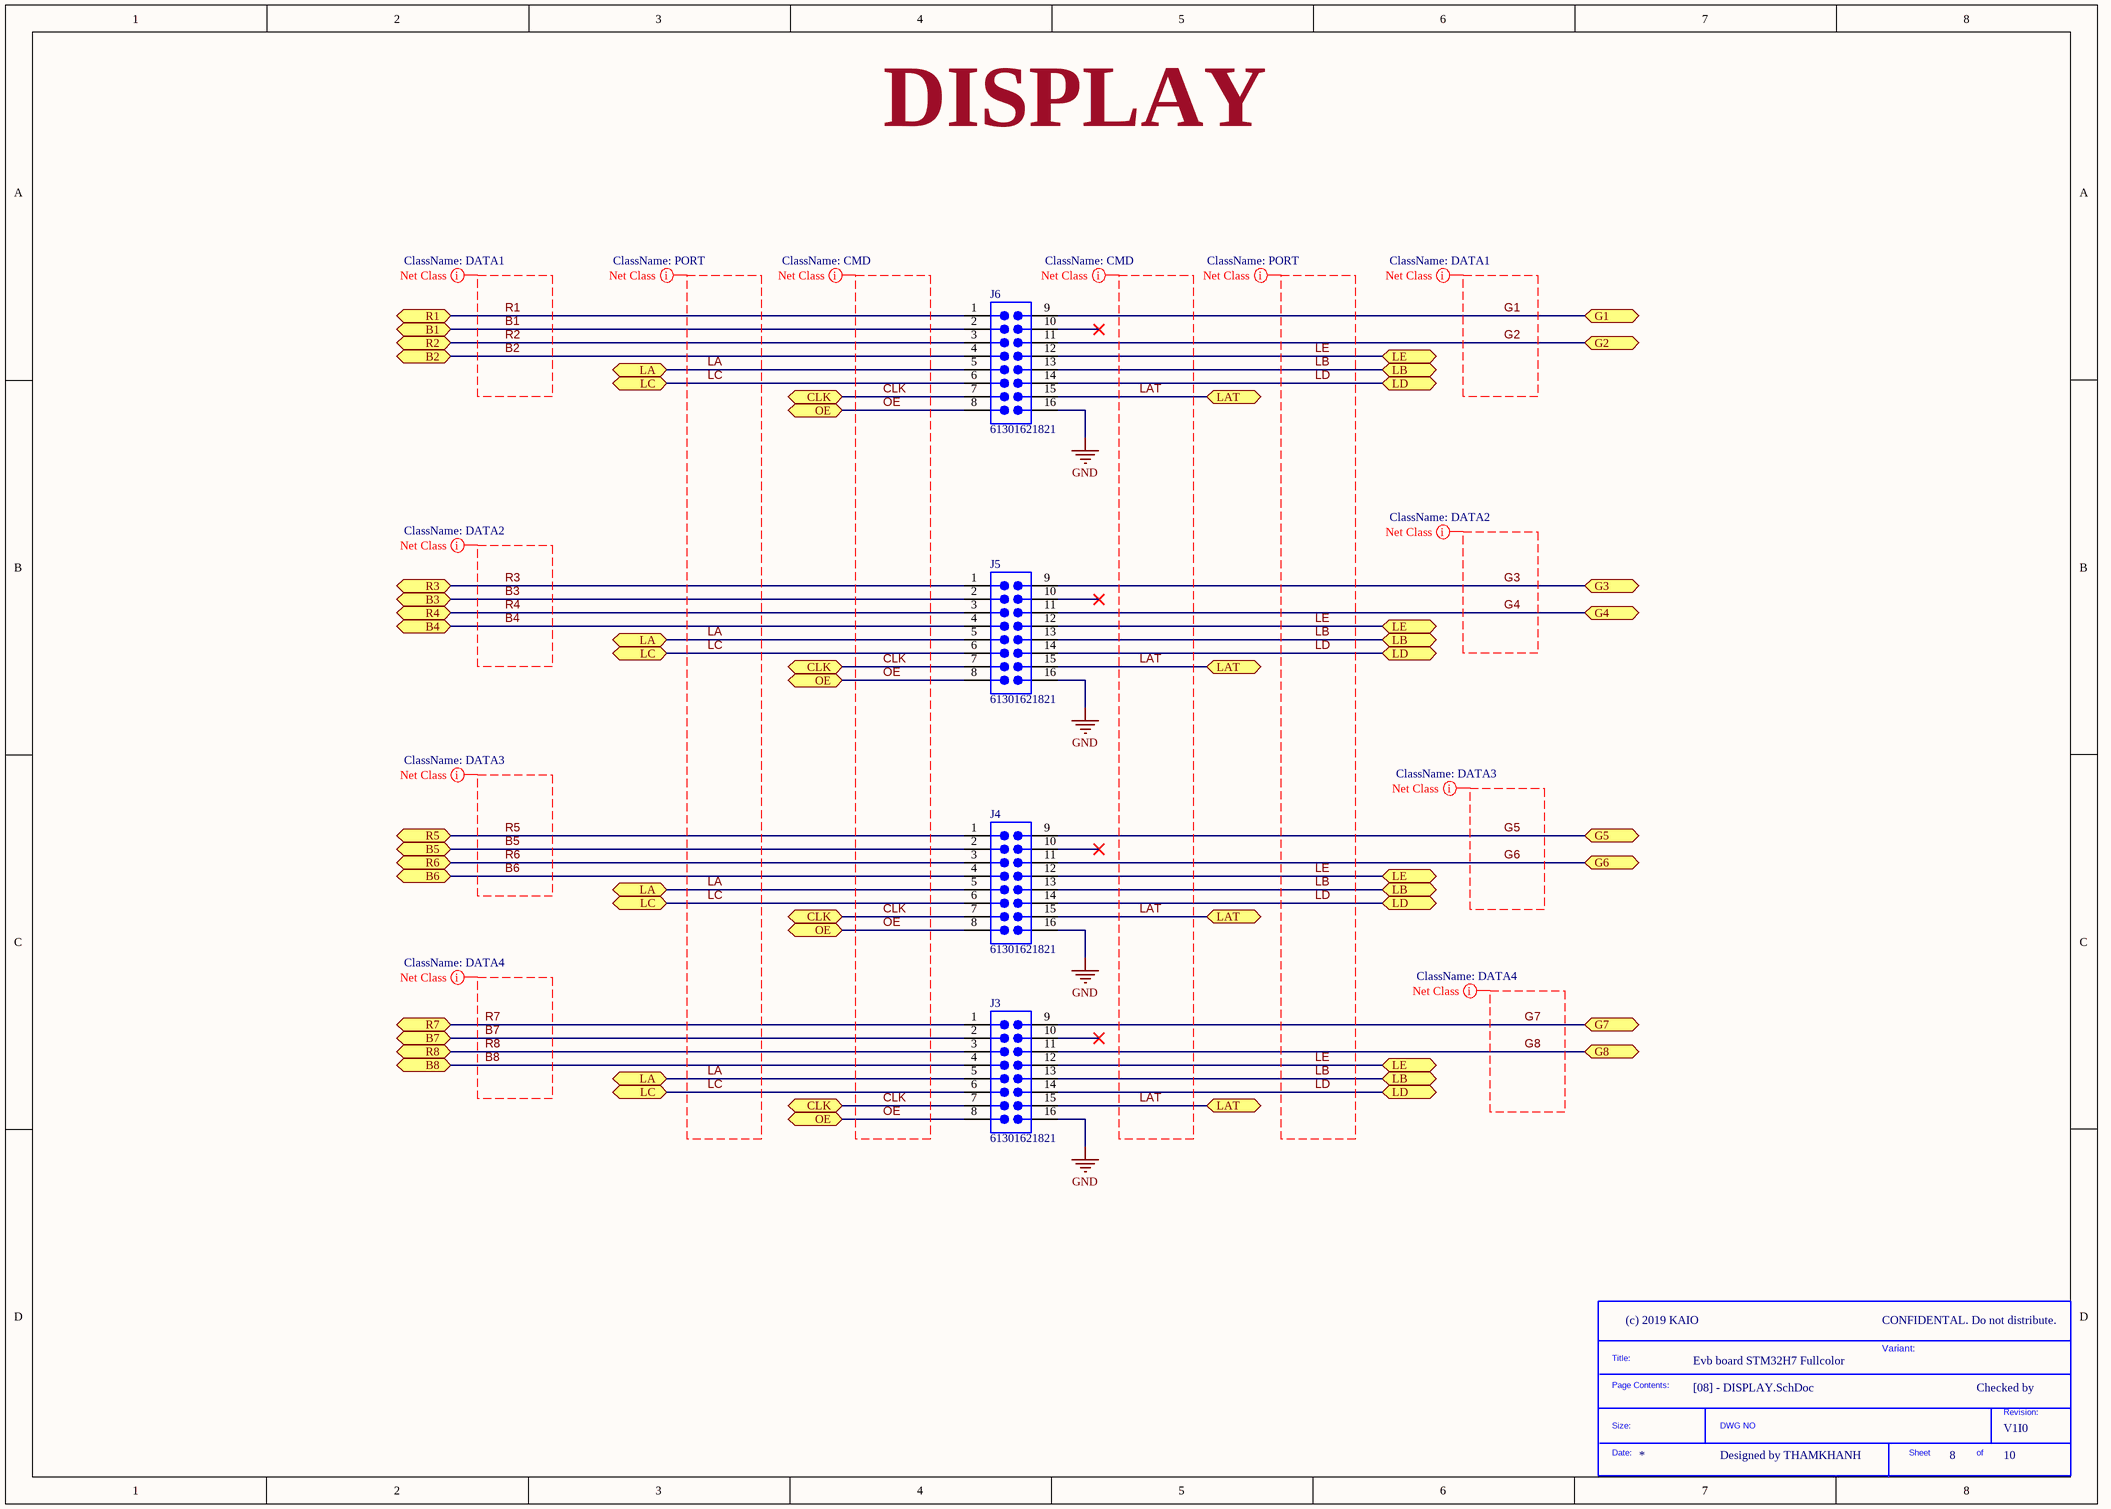
[diagram p9: [08] - DISPLAY.SchDoc]

### Parts
(Parts that share a designator on the sheet are numbered #1, #2 ... from top to bottom, then left to right.)
*?#9  SDTitleBlock  (value not drawn)  (graphical)
J3  61301621821  [61301621821]
J4  61301621821  [61301621821]
J5  61301621821  [61301621821]
J6  61301621821  [61301621821]

### Ports
B1 (bidir), B2 (bidir), B3 (bidir), B4 (bidir), B5 (bidir), B6 (bidir), B7 (bidir), B8 (bidir), CLK (bidir), G1 (bidir), G2 (bidir), G3 (bidir), G4 (bidir), G5 (bidir), G6 (bidir), G7 (bidir), G8 (bidir), LA (bidir), LAT (bidir), LB (bidir), LC (bidir), LD (bidir), LE (bidir), OE (bidir), R1 (bidir), R2 (bidir), R3 (bidir), R4 (bidir), R5 (bidir), R6 (bidir), R7 (bidir), R8 (bidir)

### Nets
GND: J3.16 J4.16 J5.16 J6.16
B1: J6.2 ; port B1
B2: J6.4 ; port B2
B3: J5.2 ; port B3
B4: J5.4 ; port B4
B5: J4.2 ; port B5
B6: J4.4 ; port B6
B7: J3.2 ; port B7
B8: J3.4 ; port B8
CLK: J3.7 J4.7 J5.7 J6.7 ; port CLK
G1: J6.9 ; port G1
G2: J6.11 ; port G2
G3: J5.9 ; port G3
G4: J5.11 ; port G4
G5: J4.9 ; port G5
G6: J4.11 ; port G6
G7: J3.9 ; port G7
G8: J3.11 ; port G8
LA: J3.5 J4.5 J5.5 J6.5 ; port LA
LAT: J3.15 J4.15 J5.15 J6.15 ; port LAT
LB: J3.13 J4.13 J5.13 J6.13 ; port LB
LC: J3.6 J4.6 J5.6 J6.6 ; port LC
LD: J3.14 J4.14 J5.14 J6.14 ; port LD
LE: J3.12 J4.12 J5.12 J6.12 ; port LE
OE: J3.8 J4.8 J5.8 J6.8 ; port OE
R1: J6.1 ; port R1
R2: J6.3 ; port R2
R3: J5.1 ; port R3
R4: J5.3 ; port R4
R5: J4.1 ; port R5
R6: J4.3 ; port R6
R7: J3.1 ; port R7
R8: J3.3 ; port R8

Not connected (* = marked no-connect by the designer): J3 10*; J4 10*; J5 10*; J6 10*

### Layout directives
net class CMD: CLK, LAT, OE
net class DATA1: B1, B2, G1, G2, R1, R2
net class PORT: LA, LB, LC, LD, LE
net class DATA2: B3, B4, G3, G4, R3, R4
net class DATA3: B5, B6, G5, G6, R5, R6
net class DATA4: B7, B8, G7, G8, R7, R8

### Notes on the sheet
- DISPLAY
- CONFIDENTAL. Do not distribute.
- Variant:
- Checked by
- Designed by THAMKHANH
- Title
- Size:
- Date:
- A3
- Number:
- Time:
- Revision:
- Sheet
- of
- File:
- (in symbol SDTitleBlock) Title:; Page Contents:; Revision:; Size:; DWG NO; Date:; Sheet; of

### Library data of the parts
J3-J6 = JP8 2.54MM Dual Socket: 2.54 mm Dual Socket Header, 16p; PublishedDate: July 2016; Publisher: Wurth Elektronik; ComponentLink1Description: Manufacturer; ComponentLink1URL: http://www.we-online.de; ComponentLink2Description: Datasheet; ComponentLink2URL: http://katalog.we-online.de/em/datasheet/6130xx21821.pdf; PartNumber: 61301621821; PinNumber: 16p

## Nets that join several sheets
+3.3V: [03] - POWER (17 pins), [04] - MCU (R2.1 U2.2), [05] - FLASH, MICROSD (C16.1 XS1.4), [07] - OTHER (IR1.3 J2.4)
+5V: [03] - POWER (AS1.3 C5.1 C7.1 K1.1), [06] - AUDIO (U4.6 U5.6), [07] - OTHER (USB1.1)
GND: [03] - POWER (22 pins), [04] - MCU (19 pins), [05] - FLASH, MICROSD (C16.2 XS1.0 XS1.6), [06] - AUDIO (10 pins), [07] - OTHER (6 pins), [08] - DISPLAY (J3.16 J4.16 J5.16 J6.16)
B1: [04] - MCU (U1.3), [08] - DISPLAY (J6.2)
B2: [04] - MCU (U1.37), [08] - DISPLAY (J6.4)
B3: [04] - MCU (U1.40), [08] - DISPLAY (J5.2)
B4: [04] - MCU (U1.43), [08] - DISPLAY (J5.4)
B5: [04] - MCU (U1.36), [08] - DISPLAY (J4.2)
B6: [04] - MCU (U1.91), [08] - DISPLAY (J4.4)
B7: [04] - MCU (U1.95), [08] - DISPLAY (J3.2)
B8: [04] - MCU (U1.47), [08] - DISPLAY (J3.4)
BOOT0: [03] - POWER (U1.94), [04] - MCU (R3.1)
CLK: [04] - MCU (U1.24), [08] - DISPLAY (J3.7 J4.7 J5.7 J6.7)
DAC_OU1: [04] - MCU (U1.28), [06] - AUDIO (R17.1)
DAC_OU2: [04] - MCU (U1.29), [06] - AUDIO (R15.1)
FXOSC_IN: [03] - POWER (U1.12), [04] - MCU (C14.1 Y1.1)
FXOSC_OUT: [03] - POWER (U1.13), [04] - MCU (C13.1 Y1.3)
G1: [04] - MCU (U1.2), [08] - DISPLAY (J6.9)
G2: [04] - MCU (U1.5), [08] - DISPLAY (J6.11)
G3: [04] - MCU (U1.39), [08] - DISPLAY (J5.9)
G4: [04] - MCU (U1.42), [08] - DISPLAY (J5.11)
G5: [04] - MCU (U1.35), [08] - DISPLAY (J4.9)
G6: [04] - MCU (U1.90), [08] - DISPLAY (J4.11)
G7: [04] - MCU (U1.93), [08] - DISPLAY (J3.9)
G8: [04] - MCU (U1.46), [08] - DISPLAY (J3.11)
IR: [04] - MCU (U1.98), [07] - OTHER (IR1.1)
LA: [04] - MCU (U1.15), [08] - DISPLAY (J3.5 J4.5 J5.5 J6.5)
LAT: [04] - MCU (U1.22), [08] - DISPLAY (J3.15 J4.15 J5.15 J6.15)
LB: [04] - MCU (U1.16), [08] - DISPLAY (J3.13 J4.13 J5.13 J6.13)
LC: [04] - MCU (U1.17), [08] - DISPLAY (J3.6 J4.6 J5.6 J6.6)
LD: [04] - MCU (U1.18), [08] - DISPLAY (J3.14 J4.14 J5.14 J6.14)
LE: [04] - MCU (U1.32), [08] - DISPLAY (J3.12 J4.12 J5.12 J6.12)
NRST: [03] - POWER (U1.14), [04] - MCU (C15.1 R2.2)
OE: [04] - MCU (U1.23), [08] - DISPLAY (J3.8 J4.8 J5.8 J6.8)
R1: [04] - MCU (U1.1), [08] - DISPLAY (J6.1)
R2: [04] - MCU (U1.4), [08] - DISPLAY (J6.3)
R3: [04] - MCU (U1.38), [08] - DISPLAY (J5.1)
R4: [04] - MCU (U1.41), [08] - DISPLAY (J5.3)
R5: [04] - MCU (U1.34), [08] - DISPLAY (J4.1)
R6: [04] - MCU (U1.89), [08] - DISPLAY (J4.3)
R7: [04] - MCU (U1.92), [08] - DISPLAY (J3.1)
R8: [04] - MCU (U1.96), [08] - DISPLAY (J3.3)
SD_CD: [04] - MCU (U1.67), [05] - FLASH, MICROSD (XS1.9)
SD_CLK: [04] - MCU (U1.80), [05] - FLASH, MICROSD (XS1.5)
SD_CMD: [04] - MCU (U1.83), [05] - FLASH, MICROSD (XS1.3)
SD_DAT0: [04] - MCU (U1.65), [05] - FLASH, MICROSD (XS1.7)
SD_DAT1: [04] - MCU (U1.66), [05] - FLASH, MICROSD (XS1.8)
SD_DAT2: [04] - MCU (U1.78), [05] - FLASH, MICROSD (XS1.1)
SD_DAT3: [04] - MCU (U1.79), [05] - FLASH, MICROSD (XS1.2)
SWCLK: [04] - MCU (U1.76), [07] - OTHER (J2.1)
SWDIO: [04] - MCU (U1.72), [07] - OTHER (J2.2)
VBAT: [03] - POWER (P1.1), [04] - MCU (U2.14)

## Assembly variants
Production: not fitted C177 C178 C179 C210 C237 C252 C263 C264 C327 C328 C390 C391 C392 C393 C406 C407 C408 C409 C410 C411 C416 C417 C418 C432 C433 D4 D8 D28 D29 D30 D31 D32 D36 D38 D39 FB2 FB8 FB17 FB20 FB26 FB29 FB32 FB35 FB38 FB41 FB42 FB43 L12 LINK1 LINK2 Q14 R15 R21 R24 R41 R52 R53 R54 R57 R58 R60 R65 R67 R68 R70 R87 R93 R104 R110 R114 R117 R119 R121 R123 R126 R128 R135 R138 R147 R148 R158 R159 R167 R168 R171 R174 R177 R178 R182 R191 R197 R199 R203 R207 R208 R209 R210 R211 R215 R216 R217 R234 R236 R239 R245 R250 R258 R261 R266 R271 R272 R274 R281 R282 R287 R290 R291 R294 R295 R298 R304 R310 R313 R316 R322 R325 R328 R331 R334 R335 R336 R337 R338 R339 R340 R341 R342 R343 R344 R347 R350 R352 R355 R357 R359 R360 R365 R367 R368 R371 R373 R374 R376 R378 R383 R385 R386 R387 R388 R392 R393 R394 R395 R396 R400 R401 R403 R408 R411 R412 R413 U17 U30 U34